# EAGLE design USB_Tester_STM32F429-DISC1 (EAGLE 6.5.0)

## Sheet 1 of 5: Breakout: Add-on to STM32F429i-DISC1 Dev Board
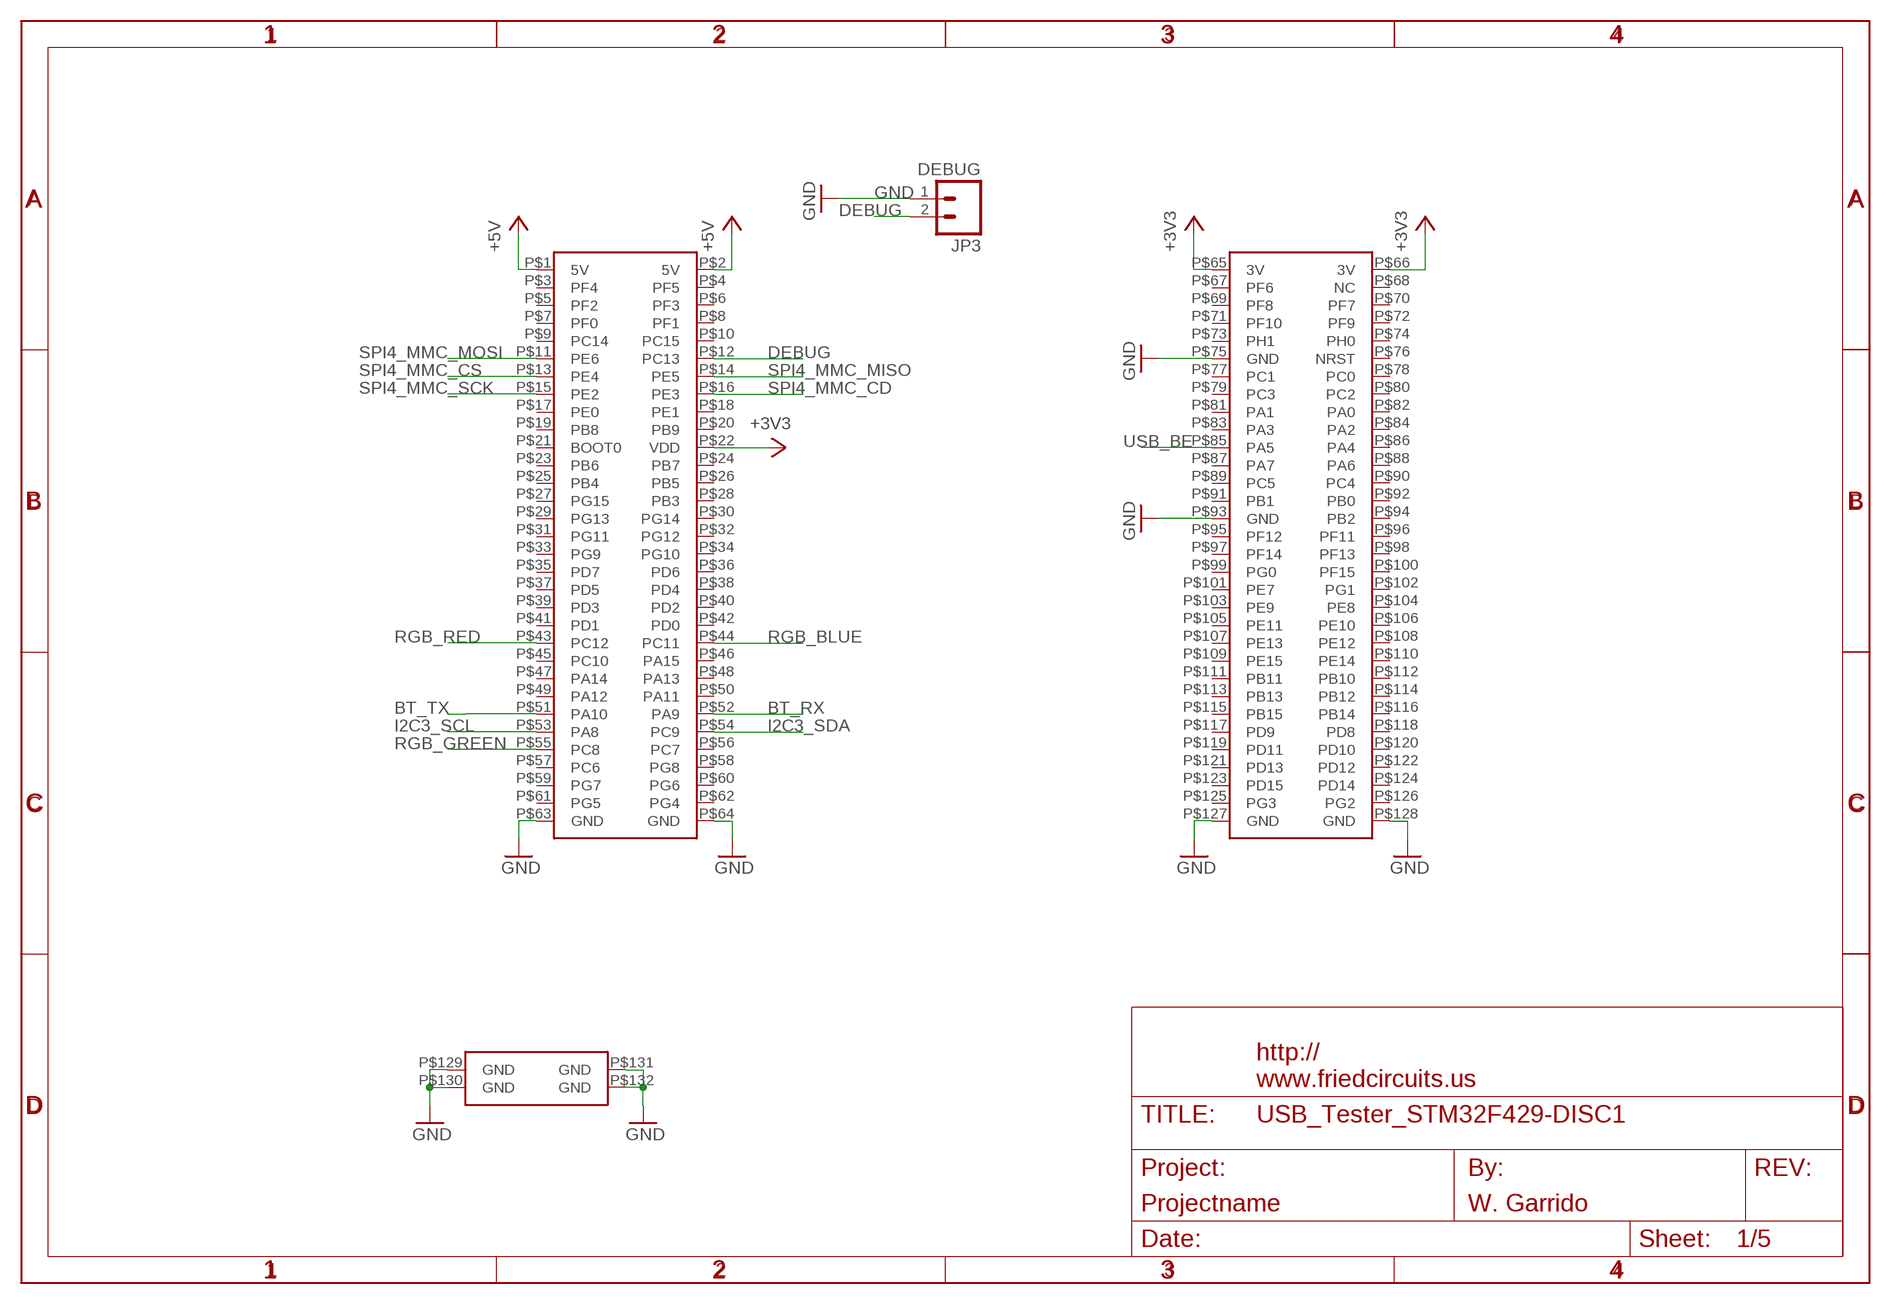
[diagram p0: schematic, sheet 1]

### Parts
JP3  DEBUG  M02LOCK  [1X02_LOCK]
U$1  STM32F429-DISCO  [STM32F429-DISCO]
U$3  FRAME_DINA4_L  [FC_CREDIT]

### Nets
+3V3: U$1.P$22(VDD) U$1.P$65(3V) U$1.P$66(3V) ; also sheet 2,3,4
+5V: U$1.P$1(5V) U$1.P$2(5V) ; also sheet 5
BT_RX: U$1.P$52(PA9) ; also sheet 4
BT_TX: U$1.P$51(PA10) ; also sheet 4
DEBUG: JP3.2 U$1.P$12(PC13)
GND: JP3.1 U$1.P$63(GND) U$1.P$64(GND) U$1.P$75(GND) U$1.P$93(GND) U$1.P$127(GND) U$1.P$128(GND) U$1.P$129(GND) U$1.P$130(GND) U$1.P$131(GND) U$1.P$132(GND) ; also sheet 2,3,4,5
I2C3_SCL: U$1.P$53(PA8) ; also sheet 2
I2C3_SDA: U$1.P$54(PC9) ; also sheet 2
RGB_BLUE [VCC]: U$1.P$44(PC11) ; also sheet 3
RGB_GREEN: U$1.P$55(PC8) ; also sheet 3
RGB_RED [VCC]: U$1.P$43(PC12) ; also sheet 3
SPI4_MMC_CD: U$1.P$16(PE3) ; also sheet 4
SPI4_MMC_CS: U$1.P$13(PE4) ; also sheet 4
SPI4_MMC_MISO: U$1.P$14(PE5) ; also sheet 4
SPI4_MMC_MOSI: U$1.P$11(PE6) ; also sheet 4
SPI4_MMC_SCK: U$1.P$15(PE2) ; also sheet 4
USB_BE: U$1.P$85(PA5) ; also sheet 3
Unconnected: U$1.P$3(PF4) U$1.P$4(PF5) U$1.P$5(PF2) U$1.P$6(PF3) U$1.P$7(PF0) U$1.P$8(PF1) U$1.P$9(PC14) U$1.P$10(PC15) U$1.P$17(PE0) U$1.P$18(PE1) U$1.P$19(PB8) U$1.P$20(PB9) U$1.P$21(BOOT0) U$1.P$23(PB6) U$1.P$24(PB7) U$1.P$25(PB4) U$1.P$26(PB5) U$1.P$27(PG15) U$1.P$28(PB3) U$1.P$29(PG13) U$1.P$30(PG14) U$1.P$31(PG11) U$1.P$32(PG12) U$1.P$33(PG9) U$1.P$34(PG10) U$1.P$35(PD7) U$1.P$36(PD6) U$1.P$37(PD5) U$1.P$38(PD4) U$1.P$39(PD3) U$1.P$40(PD2) U$1.P$41(PD1) U$1.P$42(PD0) U$1.P$45(PC10) U$1.P$46(PA15) U$1.P$47(PA14) U$1.P$48(PA13) U$1.P$49(PA12) U$1.P$50(PA11) U$1.P$56(PC7) U$1.P$57(PC6) U$1.P$58(PG8) U$1.P$59(PG7) U$1.P$60(PG6) U$1.P$61(PG5) U$1.P$62(PG4) U$1.P$67(PF6) U$1.P$68(NC) U$1.P$69(PF8) U$1.P$70(PF7) U$1.P$71(PF10) U$1.P$72(PF9) U$1.P$73(PH1) U$1.P$74(PH0) U$1.P$76(NRST) U$1.P$77(PC1) U$1.P$78(PC0) U$1.P$79(PC3) U$1.P$80(PC2) U$1.P$81(PA1) U$1.P$82(PA0) U$1.P$83(PA3) U$1.P$84(PA2) U$1.P$86(PA4) U$1.P$87(PA7) U$1.P$88(PA6) U$1.P$89(PC5) U$1.P$90(PC4) U$1.P$91(PB1) U$1.P$92(PB0) U$1.P$94(PB2) U$1.P$95(PF12) U$1.P$96(PF11) U$1.P$97(PF14) U$1.P$98(PF13) U$1.P$99(PG0) U$1.P$100(PF15) U$1.P$101(PE7) U$1.P$102(PG1) U$1.P$103(PE9) U$1.P$104(PE8) U$1.P$105(PE11) U$1.P$106(PE10) U$1.P$107(PE13) U$1.P$108(PE12) U$1.P$109(PE15) U$1.P$110(PE14) U$1.P$111(PB11) U$1.P$112(PB10) U$1.P$113(PB13) U$1.P$114(PB12) U$1.P$115(PB15) U$1.P$116(PB14) U$1.P$117(PD9) U$1.P$118(PD8) U$1.P$119(PD11) U$1.P$120(PD10) U$1.P$121(PD13) U$1.P$122(PD12) U$1.P$123(PD15) U$1.P$124(PD14) U$1.P$125(PG3) U$1.P$126(PG2)

## Sheet 2 of 5: INA219
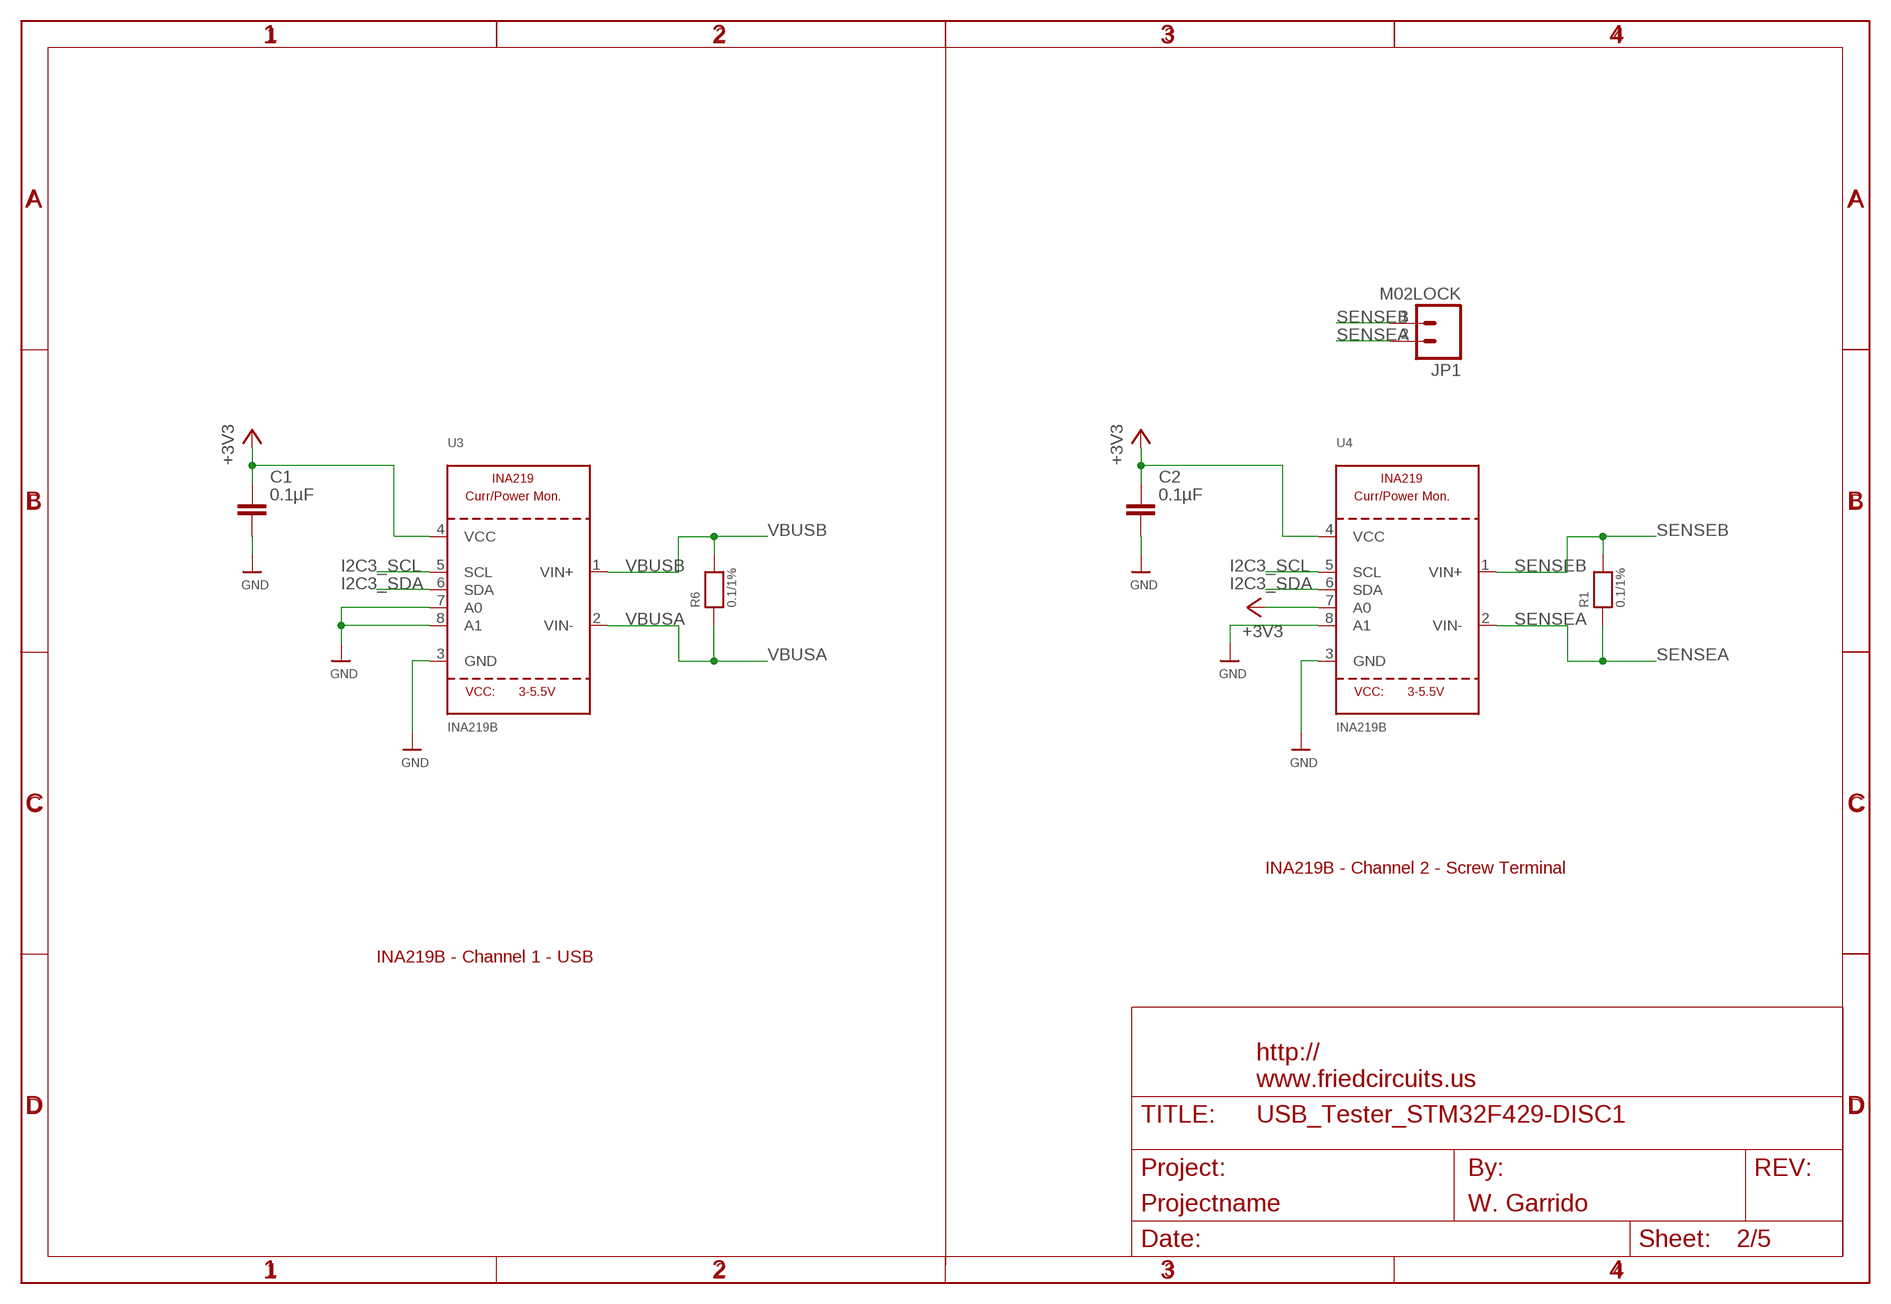
[diagram p1: schematic, sheet 2]

### Parts
C1  0.1µF  CAPACITOR_NPOL-0603  [C603]
C2  0.1µF  CAPACITOR_NPOL-0603  [C603]
JP1  M02LOCK  [1X02_LOCK]
R1  0.1/1%  RESISTOR2512  [2512]
R6  0.1/1%  RESISTOR2512  [2512]
U3  INA219B  INA219  [SOT23-8]
U4  INA219B  INA219  [SOT23-8]
U$4  FRAME_DINA4_L  [FC_CREDIT]

### Nets
+3V3: C1.1 C2.1 U3.4(VCC) U4.4(VCC) U4.7(A0) ; also sheet 1,3,4
GND: C1.2 C2.2 U3.3(GND) U3.7(A0) U3.8(A1) U4.3(GND) U4.8(A1) ; also sheet 1,3,4,5
I2C3_SCL: U3.5(SCL) U4.5(SCL) ; also sheet 1
I2C3_SDA: U3.6(SDA) U4.6(SDA) ; also sheet 1
SENSEA [VA]: JP1.2 R1.1 U4.2(VIN-) ; also sheet 3
SENSEB [VA]: JP1.1 R1.2 U4.1(VIN+) ; also sheet 3
VBUSA [VBUS]: R6.1 U3.2(VIN-) ; also sheet 3
VBUSB [VBUS]: R6.2 U3.1(VIN+) ; also sheet 3,5

### Notes on the sheet
- INA219B - Channel 2 - Screw Terminal
- INA219B - Channel 1 - USB

## Sheet 3 of 5: CH1/2/LED
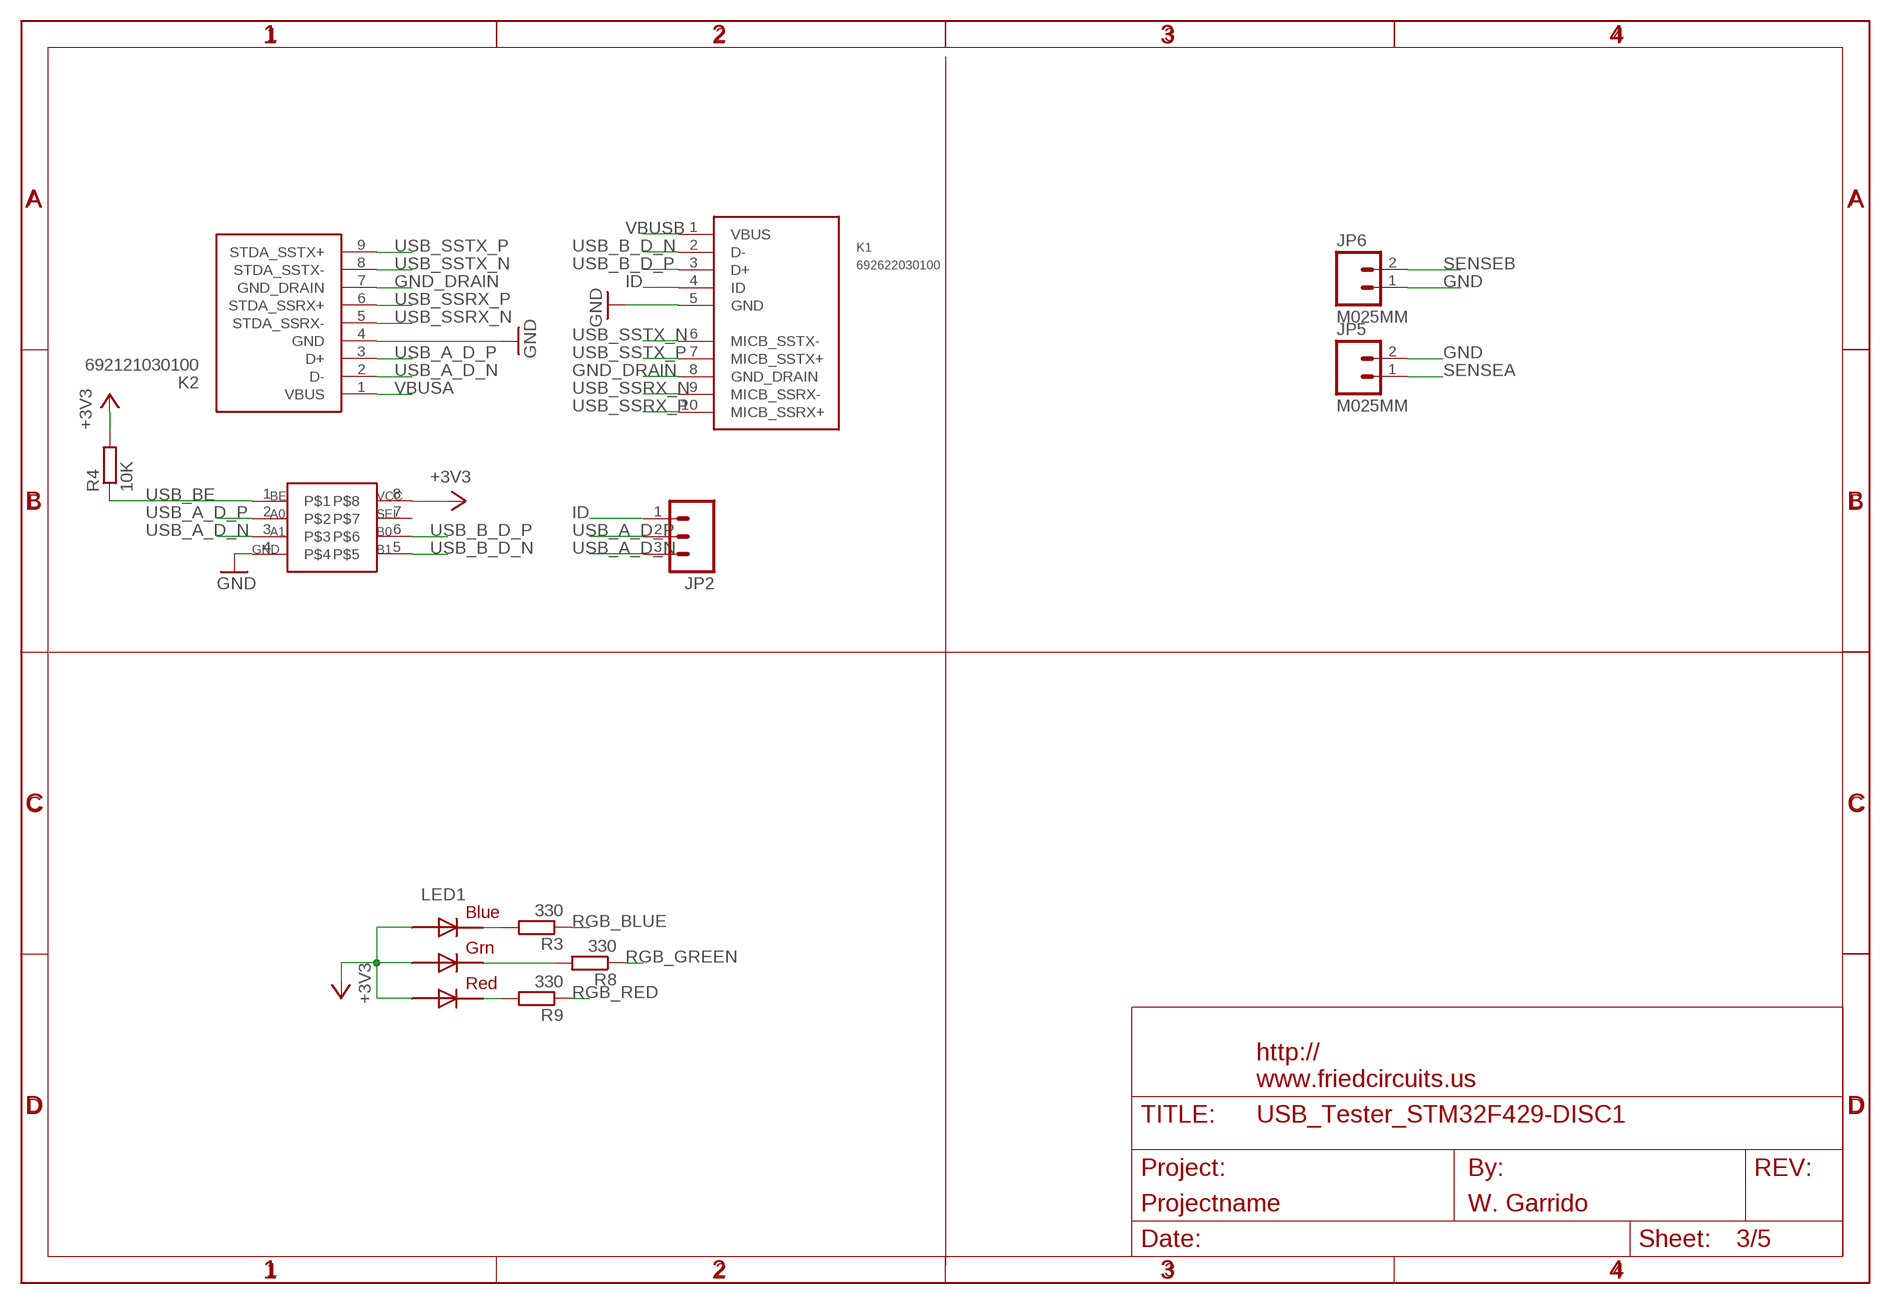
[diagram p2: schematic, sheet 3]

### Parts
JP2  M03LOCK  [1X03_LOCK]
JP5  M025MM  [SCREWTERMINAL-5MM-2]
JP6  M025MM  [SCREWTERMINAL-5MM-2]
K1  692622030100  [692622030100]
K2  692121030100  [692121030100]
LED1  RGBLED5050  [RGBLED5050]
R3  330  RESISTOR-0603  [R603]
R4  10K  RESISTOR-0603  [R603]
R8  330  RESISTOR-0603  [R603]
R9  330  RESISTOR-0603  [R603]
U$2  FRAME_DINA4_L  [FC_CREDIT]
U$17  ADG3242  [SOT23-8]

### Nets
+3V3: LED1.1(GREEN_A) LED1.2(RED_A) LED1.3(BLUE_A) R4.2 U$17.8 ; also sheet 1,2,4
GND: JP5.2 JP6.1 K1.5(GND) K2.4(GND) U$17.4 ; also sheet 1,2,4,5
GND_DRAIN: K1.8(GND_DRAIN) K2.7(GND_DRAIN)
ID: JP2.1 K1.4(ID)
N$1 [VCC]: LED1.4(BLUE_C) R3.2
N$2 [VCC]: LED1.6(GREEN_C) R8.2
N$3 [VCC]: LED1.5(RED_C) R9.2
RGB_BLUE [VCC]: R3.1 ; also sheet 1
RGB_GREEN: R8.1 ; also sheet 1
RGB_RED [VCC]: R9.1 ; also sheet 1
SENSEA [VA]: JP5.1 ; also sheet 2
SENSEB [VA]: JP6.2 ; also sheet 2
USB_A_D_N [USB_DIFF]: JP2.3 K2.2(D-) U$17.3
USB_A_D_P [USB_DIFF]: JP2.2 K2.3(D+) U$17.2
USB_B_D_N [USB_DIFF]: K1.2(D-) U$17.5
USB_B_D_P [USB_DIFF]: K1.3(D+) U$17.6
USB_BE: R4.1 U$17.1 ; also sheet 1
USB_SSRX_N [USB_DIFF]: K1.9(MICB_SSRX-) K2.5(STDA_SSRX-)
USB_SSRX_P [USB_DIFF]: K1.10(MICB_SSRX+) K2.6(STDA_SSRX+)
USB_SSTX_N [USB_DIFF]: K1.6(MICB_SSTX-) K2.8(STDA_SSTX-)
USB_SSTX_P [USB_DIFF]: K1.7(MICB_SSTX+) K2.9(STDA_SSTX+)
VBUSA [VBUS]: K2.1(VBUS) ; also sheet 2
VBUSB [VBUS]: K1.1(VBUS) ; also sheet 2,5
Unconnected: U$17.7

## Sheet 4 of 5: SD/Bluetooth
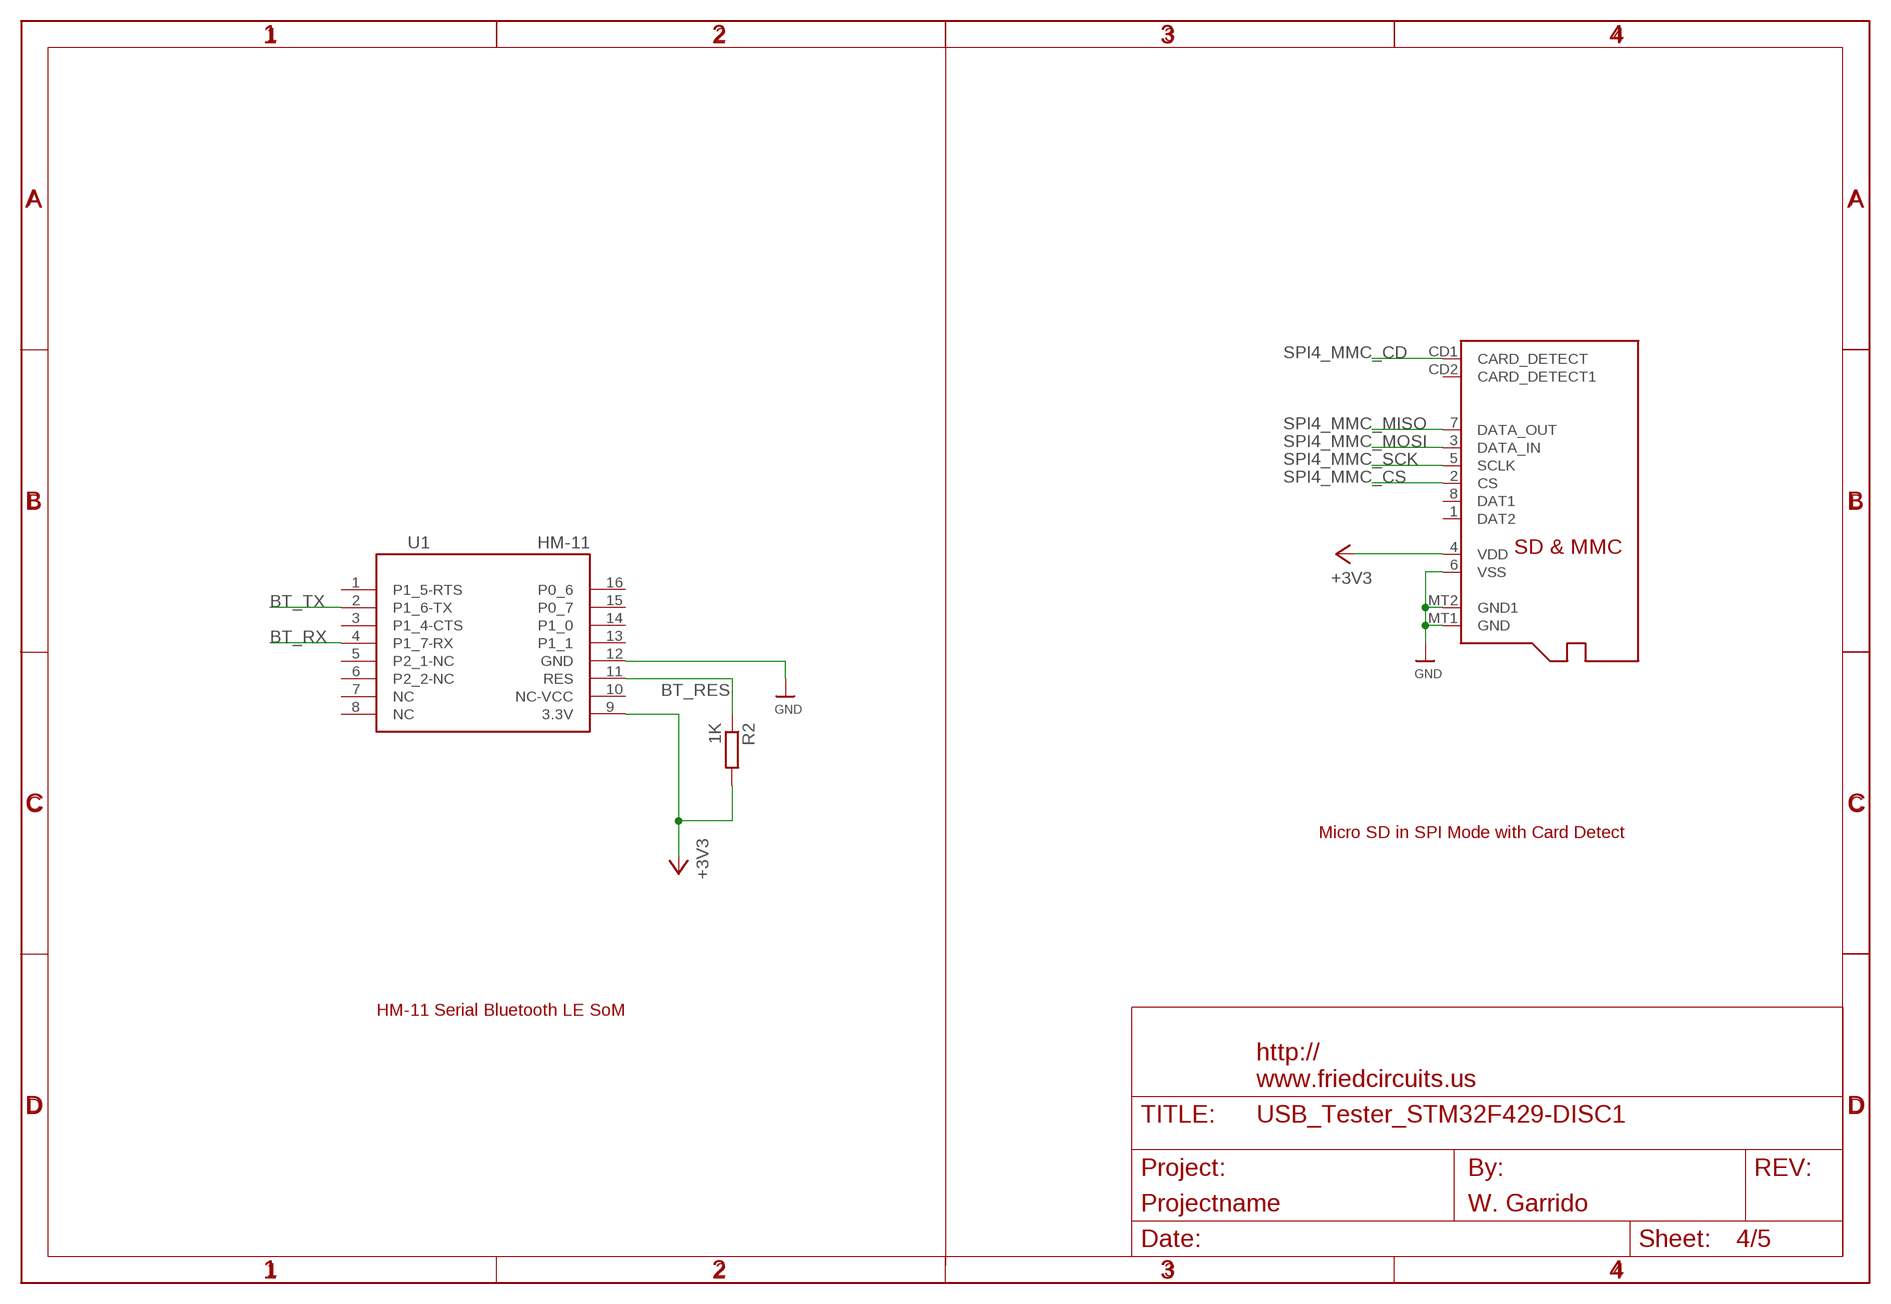
[diagram p3: schematic, sheet 4]

### Parts
R2  1K  RESISTOR-0603  [R603]
SD_CARD1  MICROSD  [MICROSD]
U1  HM-11  [HM-11]
U$5  FRAME_DINA4_L  [FC_CREDIT]

### Nets
+3V3: R2.2 SD_CARD1.4(VDD) U1.9(3.3V) ; also sheet 1,2,3
BT_RES: R2.1 U1.11(RES)
BT_RX: U1.4(P1_7-RX) ; also sheet 1
BT_TX: U1.2(P1_6-TX) ; also sheet 1
GND: SD_CARD1.6(VSS) SD_CARD1.MT1(GND) SD_CARD1.MT2(GND1) U1.12(GND) ; also sheet 1,2,3,5
SPI4_MMC_CD: SD_CARD1.CD1(CARD_DETECT) ; also sheet 1
SPI4_MMC_CS: SD_CARD1.2(CS) ; also sheet 1
SPI4_MMC_MISO: SD_CARD1.7(DATA_OUT) ; also sheet 1
SPI4_MMC_MOSI: SD_CARD1.3(DATA_IN) ; also sheet 1
SPI4_MMC_SCK: SD_CARD1.5(SCLK) ; also sheet 1
Unconnected: SD_CARD1.1(DAT2) SD_CARD1.8(DAT1) SD_CARD1.CD2(CARD_DETECT1) U1.1(P1_5-RTS) U1.3(P1_4-CTS) U1.5(P2_1-NC) U1.6(P2_2-NC) U1.7(NC) U1.8(NC) U1.10(NC-VCC) U1.13(P1_1) U1.14(P1_0) U1.15(P0_7) U1.16(P0_6)

### Notes on the sheet
- Micro SD in SPI Mode with Card Detect
- HM-11 Serial Bluetooth LE SoM

## Sheet 5 of 5: Power
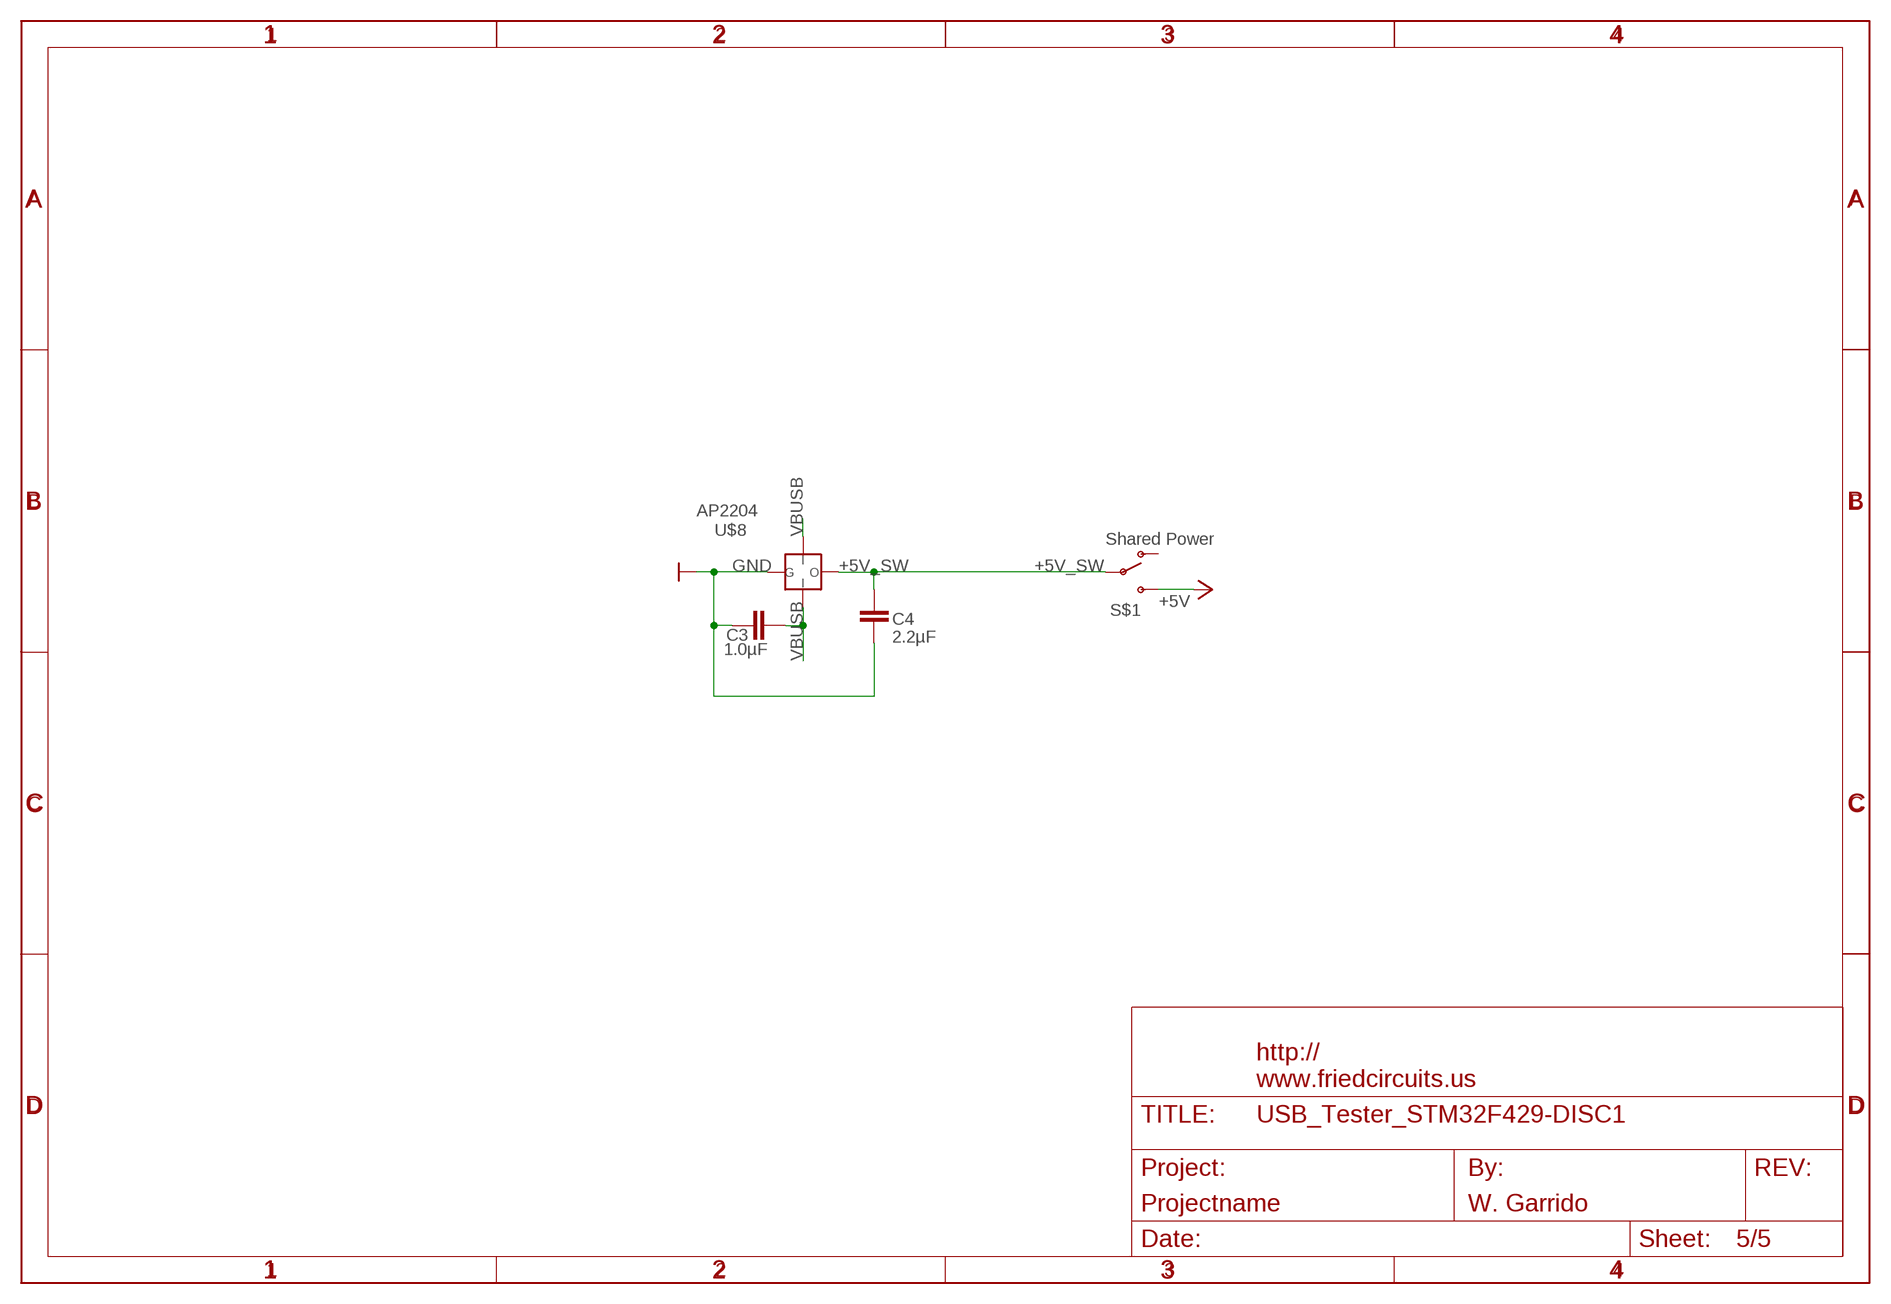
[diagram p4: schematic, sheet 5]

### Parts
C3  1.0µF  CAPACITOR_NPOL-0603  [C603]
C4  2.2µF  CAPACITOR_NPOL-0603  [C603]
S$1  Shared Power  SWITCH_SPDT  [KPS-1290]
U$6  FRAME_DINA4_L  [FC_CREDIT]
U$8  AP2204  [SOT89-3]

### Nets
+5V: S$1.S ; also sheet 1
+5V_SW: C4.1 S$1.P U$8.3(O)
GND: C3.2 C4.2 U$8.1(G) ; also sheet 1,2,3,4
VBUSB [VBUS]: C3.1 U$8.2(VIN) U$8.4(VIN) ; also sheet 2,3
Unconnected: S$1.O

## Library data of the parts
C1-C4 = dp_devices:CAPACITOR_NPOL: Non-Polarized capacitor in various packages
JP1 JP3 JP5 JP6 = SparkFun-Connectors:M02: Standard 2-pin 0.1" header. Use with - straight break away headers ( PRT-00116) - right angle break away headers (PRT-00553) - swiss pins (PRT-00743) - machine pins (PRT-00117) - female headers (PRT-00115) Molex polarized connector foot print use with: PRT-08233 with associated crimp pins and housings. 2.54_SCREWTERM for use with PRT-10571. 3.5mm Screw Terminal footprints for PRT-08084 5mm Screw Terminal footprints for use with PRT-08433
JP2 = SparkFun-Connectors:M03: Header 3 Standard 3-pin 0.1" header. Use with straight break away headers (SKU : PRT-00116), right angle break away headers (PRT-00553), swiss pins (PRT-00743), machine pins (PRT-00117), and female headers (PRT-00115). Molex polarized connector foot print use with SKU : PRT-08232 with associated crimp pins and housings.
K1 = Wuerth_Elektronik_eiCan_Communication_Connectors_v2.2:692622030100: WR-COMMICRO USB 3.0 HORIZONTAL SMT TYPE B
K2 = Wuerth_Elektronik_eiCan_Communication_Connectors_v2.2:692121030100: WR-COM USB 3.0 HORIZONTAL TYPE A
LED1 = adafruit:RGBLED: For 5050 RGB LEDs, the order of the LEDs may vary from one manufacturer to another!
R1 R6 = microbuilder:RESISTOR: Resistors 0402 - 0402 Surface Mount Package 22 Ohm 1% 1/16W [Digikey: 311-22.0LRTR-ND] 33 Ohm 5% 1/16W 1.0K 5% 1/16W 1.5K 5% 1/16W 2.0K 1% 1/16W 10.0K 1% 1/16W [Digikey: 311-10.0KLRTR-ND] 10.0K 5% 1/16W [Digikey: RMCF0402JT10K0TR-ND] 12.1K 1% 1/16W [Digikey: 311-22.0LRTR-ND] 100.0K 5% 1/16W 0603 - 0603 Surface Mount Package 0 Ohm 1/10 Watt 1% Resistor 15 Ohm 1/10 Watt 1% Resistor 33 Ohm 1/10 Watt 1% Resistor 49.9 Ohm 1/10 Watt 1% Resistor 100 Ohm 1/10 Watt 1% Resistor 150 Ohm 1/10 Watt 1% Resistor 240 Ohm 1/10 Watt 1% Resistor 390 Ohm 1/10 Watt 1% Resistor 560 Ohm 1/10 Watt 1% Resistor 680 Ohm 1/10 Watt 1% Resistor 750 Ohm 1/10 Watt 1% Resistor 1.0K Ohm 1/10 Watt 1% Resistor 1.5K Ohm 1/10 Watt 1% Resistor 2.0K Ohm 1/10 Watt 1% Resistor 2.2K Ohm 1/10 Watt 1% Resistor 3.3K Ohm 1/10 Watt 1% Resistor 4.7K Ohm 1/10 Watt 1% Resistor 10.0K Ohm 1/10 Watt 1% Resistor 12.0K Ohm 1/10 Watt 1% Resistor 12.1K Ohm 1/10 Watt 1% Resistor 20.0K Ohm 1/10 Watt 1% Resistor 33.0K Ohm 1/10 Watt 1% Resistor 100.0K Ohm 1/10 Watt 1% Resistor 0805 - 0805 Surface Mount Package 0 Ohm 1/8 Watt 1% Resistor 33 Ohm 1/8 Watt 1% Resistor 100 Ohm 1/8 Watt 1% Resistor 150 Ohm 1/8 Watt 1% Resistor 200 Ohm 1/8 Watt 1% Resistor 240 Ohm 1/8 Watt 1% Resistor 330 Ohm 1/8 Watt 1% Resistor 390 Ohm 1/8 Watt 1% Resistor 470 Ohm 1/8 Watt 1% Resistor 1.0K Ohm 1/8 Watt 1% Resistor 1.5K Ohm 1/8 Watt 1% Resistor 2.0K Ohm 1/8 Watt 1% Resistor 4.7K Ohm 1/8 Watt 1% Resistor 5.1K Ohm 1/8 Watt 1% Resistor 5.6K Ohm 1/8 Watt 1% Resistor 10.0K Ohm 1/8 Watt 1% Resistor 22.0K Ohm 1/8 Watt 1% Resistor 33.0K Ohm 1/8 Watt 1% Resistor 100K Ohm 1/8 Watt 1% Resistor 1206 - 1206 Surface Mount Package 2012 - 2010 Surface Mount Package 0.11 Ohm 1/2 Watt 1% Resistor - Digikey: RHM.11UCT-ND
R2-R4 R8 R9 = dp_devices:RESISTOR
S$1 = SparkFun-Electromechanical:SWITCH_SPDT: Side-actuated SPDT slide switch, as used on the Arduino Pro
SD_CARD1 = adafruit:MICROSD: Micro-SD / Transflash card holder with SPI pinout For the 3M # 2908-05WB-MG and/or 4UCON #19656 push-push type
U1 = FriedCircuits:HM-11: Thanks to EmbeddedArea
U3 U4 = microbuilder:INA219: INA219 - I2C Current/Power Monitor Voltage Range: 0-26V Accuracy: 0.5% Temperature: -40°C - 125°C
U$1 = MidiTrackSpecialParts:STM32F429-DISCO
U$2-U$6 = FriedCircuits:FRAME_DINA4_L: A4 FC frame Standard FriedCircuits schematic frame. Automagically adds the standard texts to the PCB Use the atrribute in the schematic editor to change the fields.; AUTHOR: W. Garrido; FF1: fulfillment by; FF2: FriedCircuits; FF3: www.friedcircuits.us; PROJECT: Projectname; URL1: http://; URL2: www.friedcircuits.us
U$8 = FriedCircuits:AP2204: Diodes Incorporated AP2204RA
U$17 = FriedCircuits:ADG3242

## Net classes
0 default: width 0.203 mm, drill 0.33 mm, clearance 0.152 mm
1 VCC: width 0.254 mm, drill 0.33 mm, clearance 0.152 mm
2 VBUS: width 0.406 mm, drill 0.33 mm, clearance 0.152 mm
4 3.3V: width 0.254 mm, drill 0.33 mm, clearance 0.152 mm
5 VA: width 1.676 mm, drill 0.33 mm, clearance 0.406 mm
6 USB_DIFF: width 0.254 mm, drill 0.33 mm, clearance 0.2 mm

## Board
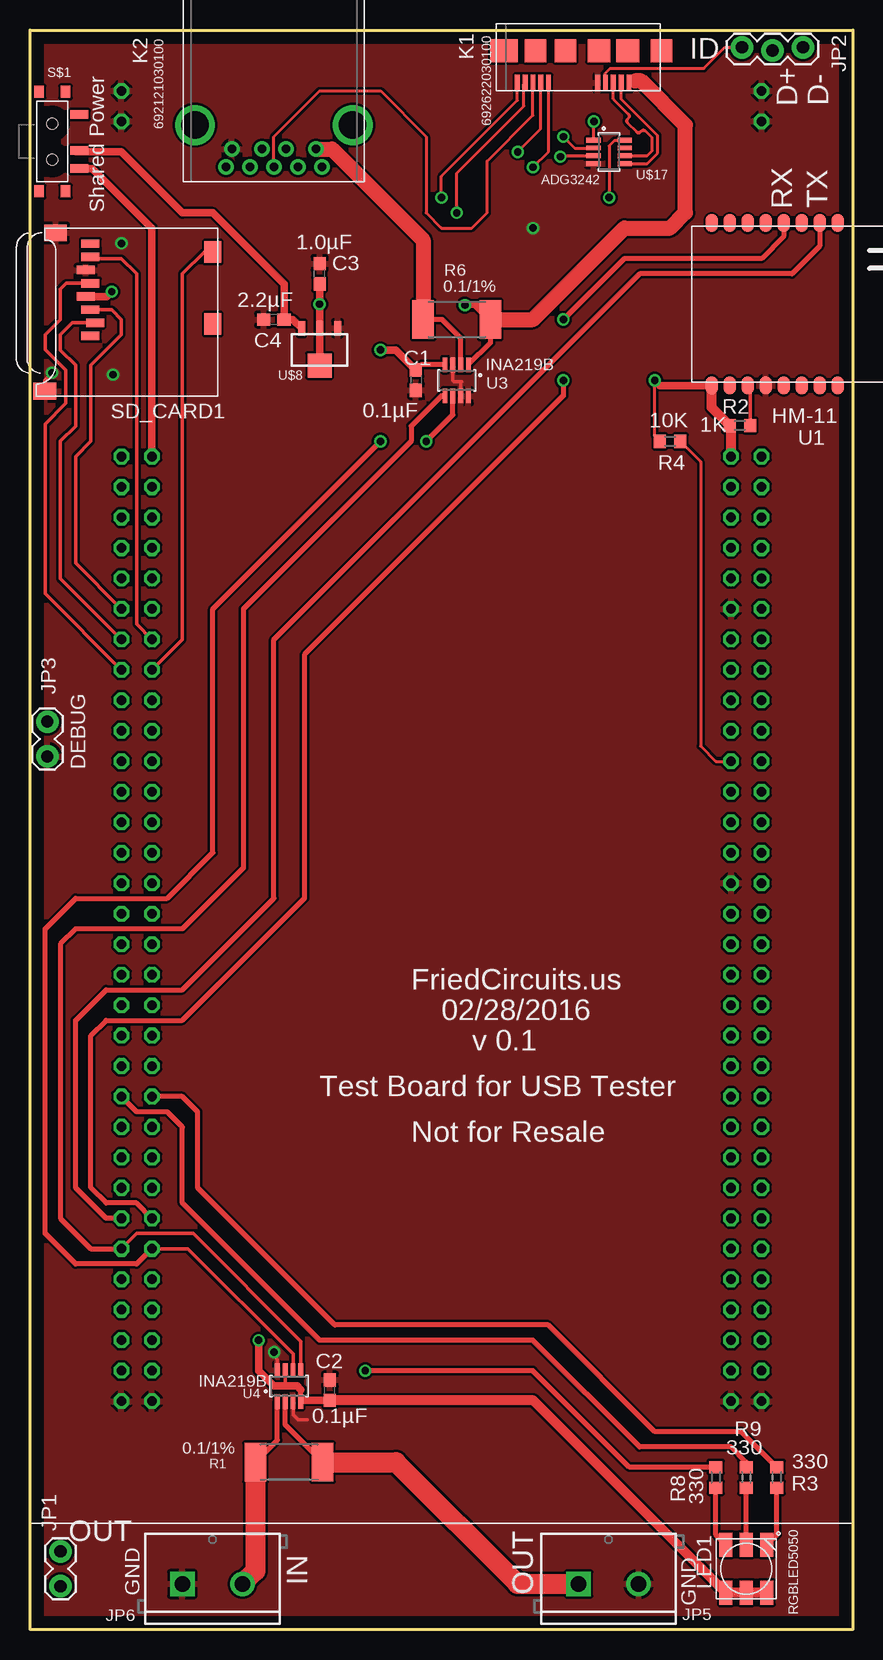
[diagram p5: board, top side]
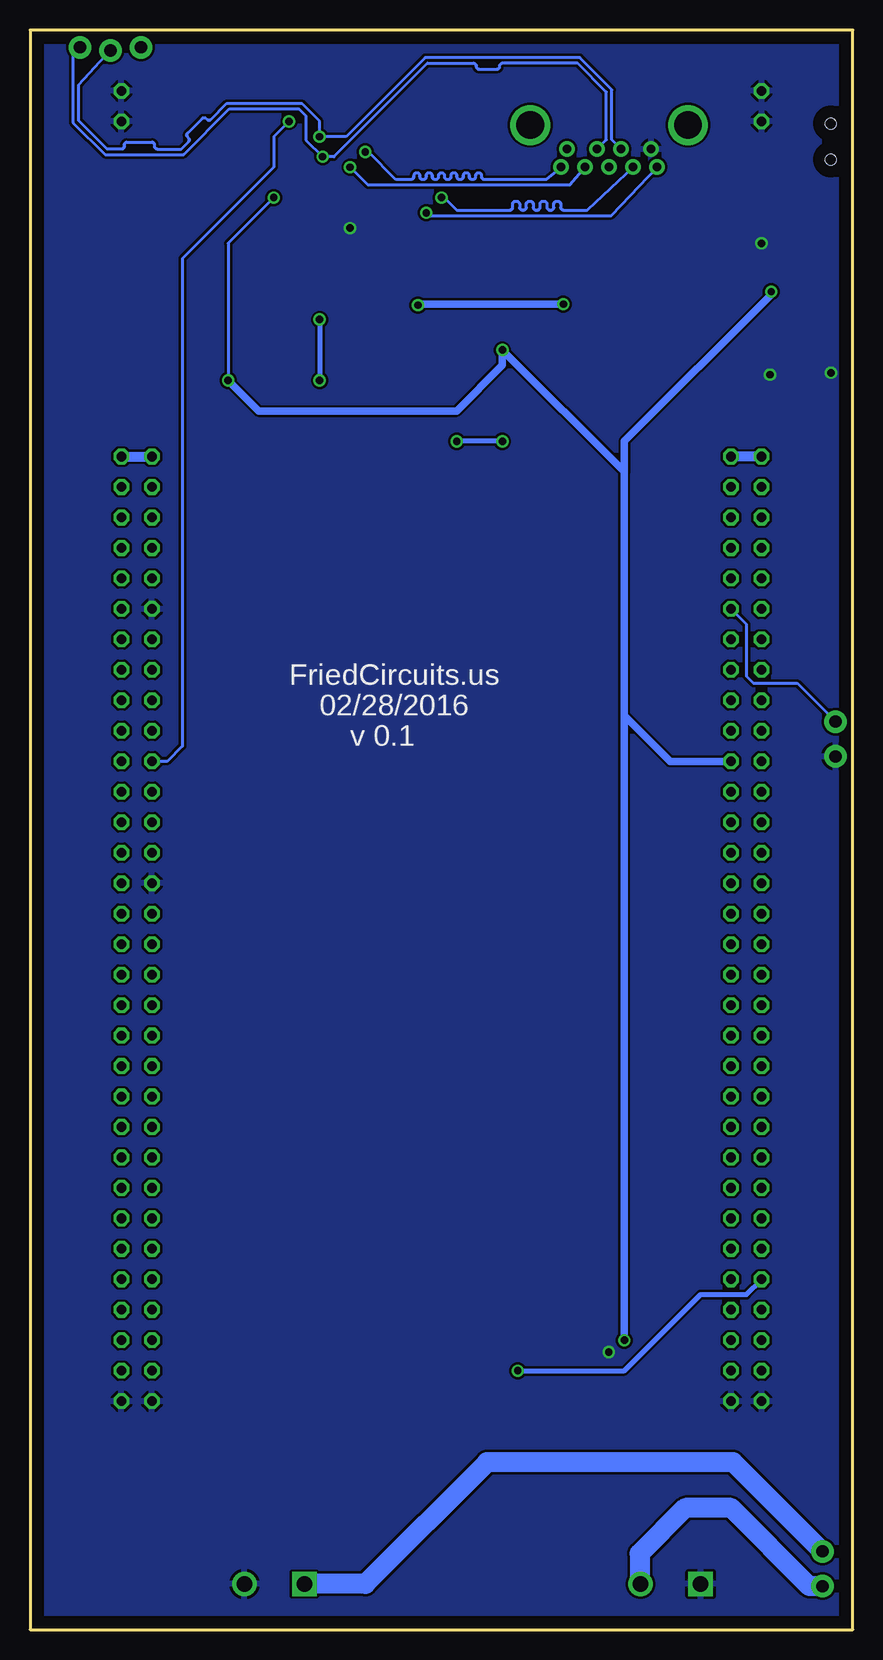
[diagram p6: board, bottom side, seen from below]

Size 68.58 x 133.35 mm. Coordinates in mm from the lower left corner, seen from the top.
Outline: 0,133.35 68.58,133.35 68.58,0 0,0 0,133.35
Copper layers (1*16): Top 0.035mm / dielectric 1.5mm / Bottom 0.035mm
Design rules "default *": minimum track width 10mil, minimum drill 24mil, track to track 8mil, track to pad 8mil, pad to pad 8mil, via to via 8mil, smd to smd 8mil, copper to edge 40mil, drill to drill 8mil, minimum pad ring 10mil, minimum via ring 8mil, stop-mask expansion 4mil, vias tented up to drill 0mil, thermal gap 10mil

### Footprints (pad centres in the part's own frame; a part is rotated, then mirrored left to right if it is on the bottom)
C603 = smd 1.1 x 1: 1 -0.85,0; 2 0.85,0
1X02_LOCK = drill 1.016 pad 1.88: 1 -0.178,0; 2 2.718,0
1X03_LOCK = drill 1.016 pad 1.88: 1 0,0.127; 2 2.54,-0.127; 3 5.08,0.127
SCREWTERMINAL-5MM-2 = drill 1.3 pad 2.032 square: 1 0,0 | drill 1.3 pad 2.032: 2 5,0
692622030100 = smd 0.4 x 1.35: 1 8,0.675; 2 7.35,0.675; 3 6.7,0.675; 4 6.05,0.675; 5 5.4,0.675; 6 1.3,0.675; 7 0.65,0.675; 8 0,0.675; 9 -0.65,0.675; 10 -1.3,0.675 | smd 1.8 x 1.9: Z1 10.7,3.35; Z4 2.7,3.35; Z5 0.2,3.35 | smd 1.9 x 1.9: Z2 7.9,3.35; Z3 5.5,3.35 | smd 2.3 x 1.9: Z6 -2.4,3.35
692121030100 = drill 0.7 pad 1.3: 1 3.5,1.5; 2 1,1.5; 3 -1,1.5; 4 -3.5,1.5; 5 -4,0; 6 -2,0; 7 0,0; 8 2,0; 9 4,0 | drill 2.3 pad 3.3: Z1 -6.57,3.5; Z2 6.57,3.5
RGBLED5050 = smd 2 x 1.1: 1 -2,1.7; 2 -2,0; 3 -2,-1.7; 4 2,-1.7; 5 2,0; 6 2,1.7
2512 = smd 1.8 x 3.2: 1 -2.8,0; 2 2.8,0
R603 = smd 1 x 1.1: 1 -0.85,0; 2 0.85,0
KPS-1290 = smd 0.7 x 1.5: O -2.25,2.25; P 0.75,2.25; S 2.25,2.25 | smd 1 x 0.8: P$1 -4.15,1.1; P$2 -4.15,-1.1; P$3 4.15,-1.1; P$4 4.15,1.1 | hole 0.9: -1.5,0; 1.5,0
MICROSD = smd 0.7 x 1.5: 1 9,-10.64; 2 7.9,-10.24; 3 6.8,-10.64; 4 5.7,-11.04; 5 4.6,-10.64; 6 3.5,-11.04; 7 2.4,-10.64; 8 1.3,-10.64 | smd 1.8 x 1.4: CD1 2,-0.44; CD2 8,-0.44 | smd 1.4 x 1.9: MT1 0.4,-13.54; MT2 13.6,-14.44
HM-11 = smd 1.5 x 1: 1 -6.77,7.62; 2 -6.77,6.12; 3 -6.77,4.62; 4 -6.77,3.12; 5 -6.77,1.62; 6 -6.77,0.12; 7 -6.77,-1.38; 8 -6.77,-2.88; 9 6.77,-2.88; 10 6.77,-1.38; 11 6.77,0.12; 12 6.77,1.62; 13 6.77,3.12; 14 6.77,4.62; 15 6.77,6.12; 16 6.77,7.62
SOT23-8 = smd 0.4 x 1.2: 1 -0.975,-1.3; 2 -0.325,-1.3; 3 0.325,-1.3; 4 0.975,-1.3; 5 0.975,1.3; 6 0.325,1.3; 7 -0.325,1.3; 8 -0.975,1.3
STM32F429-DISCO = drill 0.8 octagon: P$1 -27.94,33.02; P$2 -25.4,33.02; P$3 -27.94,30.48; P$4 -25.4,30.48; P$5 -27.94,27.94; P$6 -25.4,27.94; P$7 -27.94,25.4; P$8 -25.4,25.4; P$9 -27.94,22.86; P$10 -25.4,22.86; P$11 -27.94,20.32; P$12 -25.4,20.32; P$13 -27.94,17.78; P$14 -25.4,17.78; P$15 -27.94,15.24; P$16 -25.4,15.24; P$17 -27.94,12.7; P$18 -25.4,12.7; P$19 -27.94,10.16; P$20 -25.4,10.16; P$21 -27.94,7.62; P$22 -25.4,7.62; P$23 -27.94,5.08; P$24 -25.4,5.08; P$25 -27.94,2.54; P$26 -25.4,2.54; P$27 -27.94,0; P$28 -25.4,0; P$29 -27.94,-2.54; P$30 -25.4,-2.54; P$31 -27.94,-5.08; P$32 -25.4,-5.08; P$33 -27.94,-7.62; P$34 -25.4,-7.62; P$35 -27.94,-10.16; P$36 -25.4,-10.16; P$37 -27.94,-12.7; P$38 -25.4,-12.7; P$39 -27.94,-15.24; P$40 -25.4,-15.24; P$41 -27.94,-17.78; P$42 -25.4,-17.78; P$43 -27.94,-20.32; P$44 -25.4,-20.32; P$45 -27.94,-22.86; P$46 -25.4,-22.86; P$47 -27.94,-25.4; P$48 -25.4,-25.4; P$49 -27.94,-27.94; P$50 -25.4,-27.94; P$51 -27.94,-30.48; P$52 -25.4,-30.48; P$53 -27.94,-33.02; P$54 -25.4,-33.02; P$55 -27.94,-35.56; P$56 -25.4,-35.56; P$57 -27.94,-38.1; P$58 -25.4,-38.1; P$59 -27.94,-40.64; P$60 -25.4,-40.64; P$61 -27.94,-43.18; P$62 -25.4,-43.18; P$63 -27.94,-45.72; P$64 -25.4,-45.72; P$65 22.86,33.02; P$66 25.4,33.02; P$67 22.86,30.48; P$68 25.4,30.48; P$69 22.86,27.94; P$70 25.4,27.94; P$71 22.86,25.4; P$72 25.4,25.4; P$73 22.86,22.86; P$74 25.4,22.86; P$75 22.86,20.32; P$76 25.4,20.32; P$77 22.86,17.78; P$78 25.4,17.78; P$79 22.86,15.24; P$80 25.4,15.24; P$81 22.86,12.7; P$82 25.4,12.7; P$83 22.86,10.16; P$84 25.4,10.16; P$85 22.86,7.62; P$86 25.4,7.62; P$87 22.86,5.08; P$88 25.4,5.08; P$89 22.86,2.54; P$90 25.4,2.54; P$91 22.86,0; P$92 25.4,0; P$93 22.86,-2.54; P$94 25.4,-2.54; P$95 22.86,-5.08; P$96 25.4,-5.08; P$97 22.86,-7.62; P$98 25.4,-7.62; P$99 22.86,-10.16; P$100 25.4,-10.16; P$101 22.86,-12.7; P$102 25.4,-12.7; P$103 22.86,-15.24; P$104 25.4,-15.24; P$105 22.86,-17.78; P$106 25.4,-17.78; P$107 22.86,-20.32; P$108 25.4,-20.32; P$109 22.86,-22.86; P$110 25.4,-22.86; P$111 22.86,-25.4; P$112 25.4,-25.4; P$113 22.86,-27.94; P$114 25.4,-27.94; P$115 22.86,-30.48; P$116 25.4,-30.48; P$117 22.86,-33.02; P$118 25.4,-33.02; P$119 22.86,-35.56; P$120 25.4,-35.56; P$121 22.86,-38.1; P$122 25.4,-38.1; P$123 22.86,-40.64; P$124 25.4,-40.64; P$125 22.86,-43.18; P$126 25.4,-43.18; P$127 22.86,-45.72; P$128 25.4,-45.72; P$129 -27.94,60.96; P$130 -27.94,63.5; P$131 25.4,63.5; P$132 25.4,60.96
SOT89-3 = smd 0.58 x 1.2: 1 -1.5,-1.8; 2 0,-1.8; 3 1.5,-1.8 | smd 2 x 2: 4 0,1.3

### Placement (x,y rotation side)
C1  32.16,104.17 270 top
C2  24.99,19.96 90 top
C3  24.13,113.03 90 top
C4  20.32,109.22 180 top
JP1  2.54,3.81 90 top
JP2  59.33,131.78 0 top
JP3  1.45,72.97 90 top
JP5  45.72,3.81 0 top
JP6  12.7,3.81 0 top
K1  41.91,128.27 0 top
K2  20.32,121.92 0 top
LED1  59.69,5.08 90 top
R1  21.59,13.97 180 top
R2  59.16,100.38 180 top
R3  62.23,12.7 270 top
R4  53.34,99.06 180 top
R6  35.56,109.22 0 top
R8  57.15,12.7 270 top
R9  59.69,12.7 270 top
S$1  1.85,124.05 270 top
SD_CARD1  15.67,116.84 270 top
U1  59.69,110.49 270 top
U3  35.56,104.14 180 top
U4  21.59,20.32 0 top
U$1  35.56,64.77 0 top
U$2  -6.35,78.74 0 top  (outside the outline)
U$3  -22.86,92.71 0 top  (outside the outline)
U$4  -6.35,81.28 0 top  (outside the outline)
U$5  -6.35,76.2 0 top  (outside the outline)
U$6  -6.35,73.66 0 top  (outside the outline)
U$8  24.13,106.68 180 top
U$17  48.26,123.19 270 top

### Tracks (layer width: path | path; a pad name or v marks a point on that pad's centre or on a via)
+3V3  (via drill 0.61)
  Top 0.254: U$17.8 49.52,124.13 48.69,124.13 48.26,123.7 v48.26,119.38 | R4.2 52.07,99.48 v52.07,104.14
  Top 0.305: 22.66,19.11 22.58,19.19 | U4.7 21.31,21.57 21.29,21.55 21.29,20.62 21.59,20.32 | 58.42,100.27 R2.2
  Top 0.406: U3.4 32.58,105.44 C1.1 | 22.66,19.11 22.58,19.04 | 22.58,19.04 U4.4 | 52.49,103.72 v52.07,104.14 | 21.77,20.27 21.72,20.32 | 22.58,19.04 22.58,20.02
  Top 0.61: C2.1 22.66,19.11 | SD_CARD1.4 6.42,111.14 v6.81,111.53 | v29.21,106.68 30.49,106.68 C1.1 | U1.9 52.49,103.72 | v19.05,24.13 19.05,21.59 20.32,20.32 21.59,20.32 21.72,20.32 22.28,20.32 22.58,20.02
  Top 0.813: LED1.3 LED1.2 LED1.1 41.96,19.11 C2.1 | U$1.P$65 58.42,100.27 | R2.2 56.81,101.88 U1.9
  Bottom 0.254: v48.26,119.38 52.07,115.57 v52.07,104.14
  Bottom 0.61: v19.05,24.13 19.05,76.2 | 19.05,76.2 19.05,96.52 | 19.05,96.52 v29.21,106.68 29.21,105.41 33.02,101.6 49.53,101.6 v52.07,104.14 | U$1.P$22 15.24,72.39 19.05,76.2 | 19.05,96.52 19.05,99.06 6.81,111.3 v6.81,111.53
  Bottom 0.813: U$1.P$66 U$1.P$65
+5V
  Top 0.61: S$1.S 5.2,121.8 10.16,116.84 U$1.P$2
  Bottom 0.813: U$1.P$1 U$1.P$2
+5V_SW
  Top 0.61: U$8.3 21.89,109.22 C4.1 21.17,112.18 15.24,118.11 12.7,118.11 7.62,123.19 3.99,123.19 | 3.81,123.19 3.99,123.19 | 3.99,123.19 S$1.P
BT_RES
  Top 0.305: R2.1 60.01,103.52 U1.11
BT_RX  (via drill 0.61)
  Top 0.406: U1.4 62.81,116.15 60.96,114.3 49.53,114.3 v44.45,109.22 | U$1.P$52 8.89,35.56 6.35,35.56 5.08,36.83 5.08,49.53 6.35,50.8 12.7,50.8 22.86,60.96 22.86,81.28 44.45,102.87 v44.45,104.14
  Bottom 0.406: v44.45,109.22 v44.45,104.14
BT_TX
  Top 0.406: U1.2 65.81,115.34 63.5,113.03 50.8,113.03 20.32,82.55 20.32,60.96 12.7,53.34 6.35,53.34 3.81,50.8 3.81,36.83 6.35,34.29 U$1.P$51
DEBUG
  Bottom 0.254: U$1.P$12 8.89,83.82 8.89,79.48 8.31,78.89 4.65,78.89 JP3.2
GND  (via drill 0.61)
  Top 0.305: U3.3 35.23,104.14 35.33,104.04 35.97,104.04 35.88,103.96 U3.7 | U4.3 21.95,18.99 21.95,17.91 22.35,17.5 23.09,17.5 | U4.8 20.6,21.64 20.6,22.55 20.34,22.81 v20.34,23.14 | SD_CARD1.MT2 1.23,104.18 v1.83,104.78
  other vias: 41.91,116.84 7.62,115.57 6.91,104.62
  pour Top: 0,133.35 68.58,133.35 68.58,0 0,0
  pour Bottom: 0,133.35 68.58,133.35 68.58,0 0,0
GND_DRAIN
  Top 0.254: K2.7 20.32,124.46 24.13,128.27 29.21,128.27 33.02,124.46 33.02,118.11 34.29,116.84 36.83,116.84 38.1,118.11 38.1,122.43 41.91,126.24 K1.8
I2C3_SCL
  Top 0.305: U4.5 22.58,21.64 22.58,22.43 | U$1.P$53 8.89,33.02 13.61,33.02 22.58,24.05 22.58,22.43 | 22.55,22.45 22.58,22.43
  Top 0.406: U3.5 34.26,102.84 31.75,100.33 31.75,99.06 17.78,85.09 17.78,63.5 12.7,58.42 3.81,58.42 2.54,57.15 2.54,34.29 5.08,31.75 U$1.P$53
I2C3_SDA  (via drill 0.61)
  Top 0.305: U4.6 21.92,22.99 13.16,31.75 U$1.P$54
  Top 0.406: U$1.P$54 8.89,30.48 3.81,30.48 1.27,33.02 1.27,58.42 3.81,60.96 11.43,60.96 15.24,64.77 15.24,85.09 v29.21,99.06 | v33.02,99.06 35.23,101.28 U3.6
  Bottom 0.406: v29.21,99.06 v33.02,99.06
ID
  Top 0.254: K1.4 47.93,128.97 47.93,129.74 48.34,130.15 56.16,130.15 57.91,131.9 JP2.1
N$1
  Top 0.406: LED1.4 62.23,7.92 R3.2
N$2
  Top 0.406: LED1.6 57.15,7.92 R8.2
N$3
  Top 0.406: LED1.5 R9.2
RGB_BLUE
  Top 0.406: R3.1 59.27,16.51 52.07,16.51 43.18,25.4 25.4,25.4 13.97,36.83 13.97,43.18 12.7,44.45 U$1.P$44
RGB_GREEN  (via drill 0.61)
  Top 0.406: R8.1 49.95,13.55 41.91,21.59 v27.94,21.59
  Bottom 0.406: v27.94,21.59 19.05,21.59 12.7,27.94 8.89,27.94 U$1.P$55
RGB_RED
  Top 0.406: R9.1 59.69,13.97 58.42,15.24 50.8,15.24 41.91,24.13 24.13,24.13 12.7,35.56 12.7,41.91 11.43,43.18 8.89,43.18 U$1.P$43
SENSEA
  Top 0.406: R1.1 21.27,17.09 U4.2
  Top 1.676: R1.1 30.48,13.97 40.64,3.81 JP5.1
  Bottom 1.676: JP1.2 9.98,13.97 30.48,13.97 40.64,3.81 JP5.1
SENSEB
  Top 0.406: R1.2 20.61,15.8 U4.1
  Top 1.676: R1.2 18.79,4.9 JP6.2
  Bottom 1.676: JP1.1 3.63,3.63 10.16,10.16 13.97,10.16 17.78,6.35 17.78,3.89 JP6.2
SPI4_MMC_CD
  Top 0.305: U$1.P$16 12.7,82.55 12.7,113.03 14.51,114.84 SD_CARD1.CD1
SPI4_MMC_CS
  Top 0.305: U$1.P$13 2.54,87.63 2.54,99.06 3.81,100.33 3.81,105.41 2.54,106.68 2.54,107.95 3.53,108.94 SD_CARD1.2
SPI4_MMC_MISO
  Top 0.305: SD_CARD1.7 4.74,114.3 7.62,114.3 8.89,113.03 8.89,83.82 U$1.P$14
SPI4_MMC_MOSI
  Top 0.305: U$1.P$11 3.81,88.9 3.81,97.79 5.08,99.06 5.08,105.41 7.62,107.95 7.62,109.22 6.8,110.04 SD_CARD1.3
SPI4_MMC_SCK
  Top 0.305: U$1.P$15 1.27,86.36 1.27,100.51 3,102.23 3,104.98 1.27,106.7 1.27,107.95 2.54,109.22 2.54,111.76 3.02,112.24 SD_CARD1.5
USB_A_D_N  (via drill 0.61)
  Top 0.254: v44.2,122.78 44.28,122.86 U$17.3
  Bottom 0.254: K2.2 20.55,124.19 20.55,128.18 22.95,130.58 29.21,130.58 arc-90 29.44,130.35 29.44,130.31 arc90 29.67,130.08 31.17,130.08 arc90 31.39,130.31 31.39,130.35 arc-90 31.62,130.58 35.47,130.58 43.26,122.78 v44.2,122.78 45.59,124.18 45.59,126.19 46.18,126.77 51.98,126.77 55.78,122.96 62.33,122.96 65,125.64 65,131.55 JP2.3
USB_A_D_P  (via drill 0.61)
  Top 0.254: v44.45,124.46 45.4,123.52 U$17.2
  Bottom 0.254: K2.3 20.09,124.19 20.09,128.37 22.77,131.04 35.66,131.04 42.23,124.46 v44.45,124.46 44.45,125.73 45.95,127.23 52.16,127.23 53.5,125.89 arc90 53.83,125.89 53.9,125.97 arc-90 54.23,125.97 55.45,124.75 arc-90 55.45,124.43 55.37,124.35 arc90 55.37,124.03 55.98,123.42 57.97,123.42 arc90 58.19,123.65 58.19,123.76 arc-90 58.42,123.99 60.5,123.99 arc-90 60.73,123.76 60.73,123.65 arc90 60.96,123.42 62.13,123.42 64.54,125.83 64.54,128.75 JP2.2
USB_B_D_N
  Top 0.254: U$17.5 51.42,122.22 52.3,123.09 52.3,124.56 49.26,127.59 K1.2
USB_B_D_P
  Top 0.254: U$17.6 51.42,122.86 51.84,123.28 51.84,124.36 51.27,124.93 arc90 50.95,124.93 50.87,124.85 arc-90 50.54,124.85 49.79,125.6 arc-90 49.79,125.93 49.87,126.01 arc90 49.87,126.33 48.61,127.6 K1.3
USB_BE  (via drill 0.61)
  Top 0.254: U$17.1 46.99,124.2 v46.99,125.73 | R4.1 55.88,97.37 55.88,73.66 57.15,72.39 U$1.P$85
  Bottom 0.254: v46.99,125.73 48.26,124.46 48.26,121.92 55.88,114.3 55.88,73.66 57.15,72.39 U$1.P$85
USB_SSRX_N  (via drill 0.61)
  Top 0.254: v35.56,118.11 35.56,121.41 41.15,127 41.15,128.83 K1.9
  Bottom 0.254: K2.5 20.13,117.88 35.33,117.88 v35.56,118.11
USB_SSRX_P  (via drill 0.61)
  Top 0.254: v34.29,119.38 34.29,121.16 40.61,127.48 K1.10
  Bottom 0.254: K2.6 22.13,118.34 24.13,118.34 arc90 24.36,118.57 24.36,118.84 arc-90 24.59,119.07 24.7,119.07 arc-90 24.93,118.84 24.93,118.57 arc90 25.16,118.34 25.27,118.34 arc90 25.5,118.57 25.5,118.84 arc-90 25.73,119.07 25.84,119.07 arc-90 26.07,118.84 26.07,118.57 arc90 26.3,118.34 26.41,118.34 arc90 26.64,118.57 26.64,118.84 arc-90 26.87,119.07 26.99,119.07 arc-90 27.21,118.84 27.21,118.57 arc90 27.44,118.34 27.56,118.34 arc90 27.79,118.57 27.79,118.84 arc-90 28.01,119.07 28.13,119.07 arc-90 28.36,118.84 28.36,118.57 arc90 28.59,118.34 33.02,118.34 34.06,119.38 v34.29,119.38
USB_SSTX_N  (via drill 0.61)
  Top 0.254: v41.91,121.92 43.21,123.22 K1.6
  Bottom 0.254: K2.8 23.59,120.42 40.41,120.42 v41.91,121.92
USB_SSTX_P  (via drill 0.61)
  Top 0.254: v40.64,123.19 42.56,125.11 K1.7
  Bottom 0.254: K2.9 25.59,120.88 30.71,120.88 arc90 30.94,121.11 30.94,121.2 arc-90 31.17,121.43 31.23,121.43 arc-90 31.45,121.2 31.45,121.11 arc90 31.68,120.88 31.74,120.88 arc90 31.97,121.11 31.97,121.2 arc-90 32.2,121.43 32.26,121.43 arc-90 32.48,121.2 32.48,121.11 arc90 32.71,120.88 32.77,120.88 arc90 33,121.11 33,121.2 arc-90 33.23,121.43 33.28,121.43 arc-90 33.51,121.2 33.51,121.11 arc90 33.74,120.88 33.8,120.88 arc90 34.03,121.11 34.03,121.2 arc-90 34.26,121.43 34.31,121.43 arc-90 34.54,121.2 34.54,121.11 arc90 34.77,120.88 34.83,120.88 arc90 35.06,121.11 35.06,121.2 arc-90 35.29,121.43 35.34,121.43 arc-90 35.57,121.2 35.57,121.11 arc90 35.8,120.88 35.86,120.88 arc90 36.09,121.11 36.09,121.2 arc-90 36.31,121.43 36.37,121.43 arc-90 36.6,121.2 36.6,121.11 arc90 36.83,120.88 38.1,120.88 40.41,123.19 v40.64,123.19
VBUSA
  Top 0.406: U3.2 35.88,107.67 35.89,107.67 34.34,109.22 R6.1
  Top 1.27: K2.1 25.17,123.42 32.76,115.83 R6.1
VBUSB  (via drill 0.61)
  Top 0.406: R6.2 38.36,107.27 U3.1 | v36.25,110.41 37.17,110.41 | 50.42,129.11 50.26,128.94 K1.1
  Top 0.61: U$8.4 U$8.2 v24.13,110.49 C3.1 | 37.17,110.41 R6.2
  Top 1.27: 50.42,129.11 50.93,129.11 54.61,125.42 54.61,118.11 53.34,116.84 49.53,116.84 41.91,109.22 R6.2
  Bottom 0.406: 36.17,110.49 v36.25,110.41
  Bottom 0.61: v24.13,110.49 36.17,110.49

### Text on the board
tPlace: ID | D+ | D- | RX | TX | FriedCircuits.us | 02/28/2016 | v 0.1 | Test Board for USB Tester | Not for Resale | OUT | OUT | GND | IN | GND
bPlace: FriedCircuits.us | 02/28/2016 | v 0.1